# EAGLE design 2020_Example_USBController (EAGLE 9.5.2)
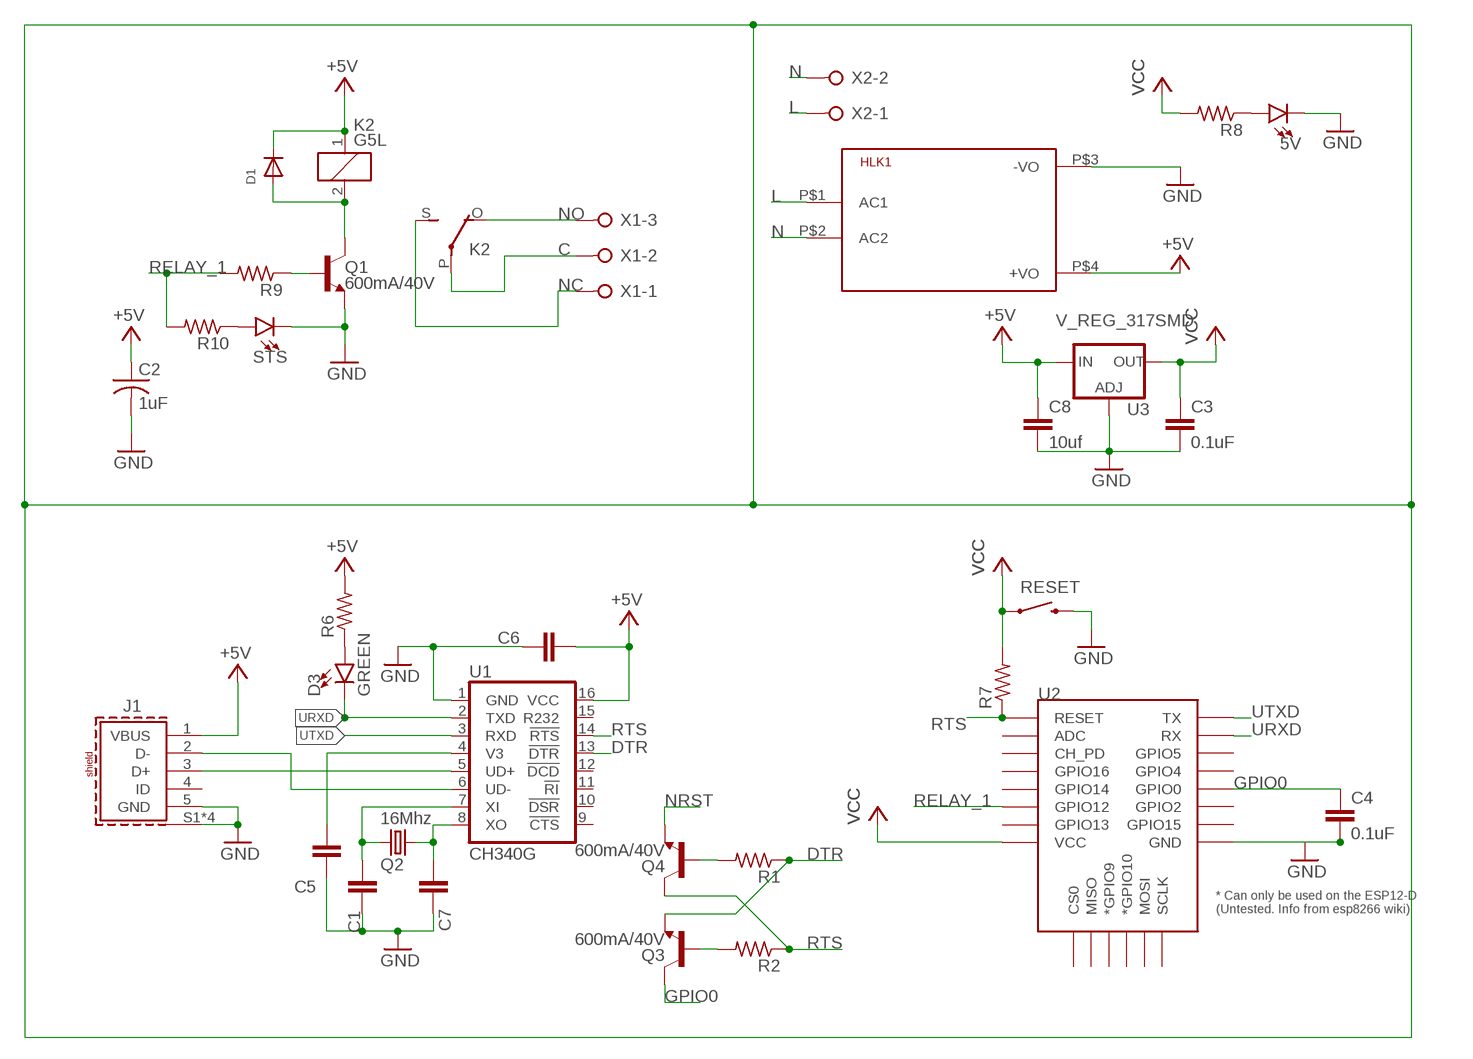
[diagram p0: schematic, sheet 1]

## Parts
5V  LED-GREEN0603  [LED-0603]
C1  10pF  C-EUC0805  [C0805]
C2  1uF  C-USC0805K  [C0805K]
C3  0.1uF  C-EUC0805  [C0805]
C4  0.1uF  C-EUC0805  [C0805]
C5  10nF  C-EUC0805  [C0805]
C6  0.1uF  C-EUC0805  [C0805]
C7  10pF  C-EUC0805  [C0805]
C8  10uf  C-EUC0805  [C0805]
D1  DIODESOD-123  [SOD-123]
D3  GREEN  LED-GREEN0603  [LED-0603]
HLK1  HLK-PM013W  [HLK-PM01]
J1  629105150521  [629105150521]
K2  G5L  [G5LE]
Q1  600mA/40V  TRANS_NPN-MMBT2222AL  [SOT23-3]
Q2  16Mhz  5032/2P  [5032/2P]
Q3  600mA/40V  TRANS_NPN-MMBT2222AL  [SOT23-3]
Q4  600mA/40V  TRANS_NPN-MMBT2222AL  [SOT23-3]
R1  R-US_R0805  [R0805]
R2  R-US_R0805  [R0805]
R6  R-US_R0805  [R0805]
R7  R-US_R0805  [R0805]
R8  R-US_R0805  [R0805]
R9  R-US_R0805  [R0805]
R10  R-US_R0805  [R0805]
RESET  RS032G05A3SM-SPST-MOMENTARY-SWSMD-1101NE  [TACTILE-SWITCH-1101NE]
STS  LED-GREEN0603  [LED-0603]
U1  CH340G  CH340GSMD  [SO016]
U2  ESP12ESMD  [ESP12E-SMD]
U3  V_REG_317SMD  [SOT223]
X1  W237-03P  [W237-133]
X2  W237-02P  [W237-132]

## Nets
+5V [usbvcc]: C2.1 C6.2 C8.1 D1.C HLK1.P$4(+VO) J1.1(VBUS) K2.1 R6.2 U1.16(VCC) U3.3(IN)
C: K2.P(2:P) X1.2
DTR: Q3.2(E) R1.1 U1.13(!DTR)
GND [gnd]: 5V.C C1.1 C2.2 C3.2 C4.2 C5.1 C6.1 C7.1 C8.2 HLK1.P$3(-VO) J1.5(GND) J1.S1(SHIELD) J1.S2(SHIELD) J1.S3(SHIELD) J1.S4(SHIELD) Q1.2(E) RESET.2 STS.C U1.1(GND) U2.GND U3.1(ADJ)
GPIO0: C4.1 Q3.3(C) U2.GPIO0
L: HLK1.P$1(AC1) X2.1
N: HLK1.P$2(AC2) X2.2
N$2: D3.A R6.1
N$3: D1.A K2.2 Q1.3(C)
N$4: J1.3(D+) U1.5(UD+)
N$5: Q1.1(B) R9.1
N$6: J1.2(D-) U1.6(UD-)
N$7: C7.2 Q2.2 U1.8(XO)
N$8: R10.1 STS.A
N$9: 5V.A R8.1
N$10: Q4.1(B) R1.2
N$12: Q3.1(B) R2.2
N$13: C1.2 Q2.1 U1.7(XI)
NC: K2.S(2:S) X1.1
NO: K2.O(2:O) X1.3
NRST: Q4.2(E)
RELAY_1: R9.2 R10.2 U2.GPIO12
RTS: Q4.3(C) R2.1 R7.1 U1.14(!RTS) U2.RESET
URXD: D3.C U1.2(TXD) U2.RXD0(RX)
UTXD: U1.3(RXD) U2.TXD0(TX)
V1: C5.2 U1.4(V3)
VCC [usbvcc]: C3.1 R7.2 R8.2 RESET.1 U2.VCC U3.2(OUT)
Unconnected: J1.4(ID) U1.9(!CTS) U1.10(!DSR) U1.11(!RI) U1.12(!DCD) U1.15(R232) U2.ADC U2.CH_PD U2.CS0 U2.GPIO2 U2.GPIO4 U2.GPIO5 U2.GPIO9(*GPIO9) U2.GPIO10(*GPIO10) U2.GPIO13 U2.GPIO14 U2.GPIO15 U2.GPIO16 U2.MISO U2.MOSI U2.SCLK

## Library data of the parts
5V STS = SparkFun-LED:LED-GREEN: Green SMD LED Used in manufacturing of various products at SparkFun Packages: 0603 - SMD 0603 package [Product Link] <http://www.futureelectronics.com/en/technologies/semiconductors/optoelectronics/leds/Pages/9894312-LTST-C190GKT.aspx?CrossPart=HSMG-C190&IM=0> LilyPad 1206 - SMD1206 LilyPad package [Product Link] <http://www.futureelectronics.com/en/Technologies/Product.aspx?ProductID=IN150NGHARVATEKCORPORATION2049943&IM=0> 1206 - SMD1206 package [Product Link] <http://www.futureelectronics.com/en/technologies/semiconductors/optoelectronics/leds/Pages/8315665-LTST-C150KGKT.aspx?IM=0> 1206 Bottom Mount -SMD 1206 Bottom Mount [Product Link] <http://www.digikey.com/product-detail/en/lite-on-inc/LTST-C230KGKT/160-1456-1-ND/386854> SparkFun Products: Pro Mini 328 -5V <https://www.sparkfun.com/products/821> RedBoard <https://www.sparkfun.com/products/12757> MP3 Trigger <https://www.sparkfun.com/products/13720> Makey Makey <https://www.sparkfun.com/products/11076>; PROD_ID: DIO-00821; VALUE: GREEN
C1 C4-C7 = resistor:C-EU: CAPACITOR, European symbol
C2 = adafruit:C-US: CAPACITOR, American symbol
C3 C8 = rcl:C-EU: CAPACITOR, European symbol
D1 = adafruit:DIODE: Diode SMADIODE - SMA Surface Mount Package 20V 1A Schottky Diode Digikey: 641-1014-6-ND DO-1N4148 - Through Hole Small Current Diode SOD-123 20V 1 A (.5mV Vf) Schottky Diode - Digikey: MBRX120TPMSCT-ND SOD-323 10V 570mA (.38mV Vf, 3ns) Schottky Diode - Digikey: ZLLS410CT-ND SOD-523 30V 30mA Schottky Diode (RB751S-40TE61) - Digikey: RB751S-40TE61CT-ND SOT23-R/W - SOT23 Package (R = Solder Paste/Reflow Ovens, W = Hand-Soldering) BAT54Film 40V 300mA - Digikey: 497-7162-1-ND
D3 = SparkFun-LED:LED-GREEN: Green SMD LED Used in manufacturing of various products at SparkFun Packages: 0603 - SMD 0603 package [Product Link] <http://www.futureelectronics.com/en/technologies/semiconductors/optoelectronics/leds/Pages/9894312-LTST-C190GKT.aspx?CrossPart=HSMG-C190&IM=0> LilyPad 1206 - SMD1206 LilyPad package [Product Link] <http://www.futureelectronics.com/en/Technologies/Product.aspx?ProductID=IN150NGHARVATEKCORPORATION2049943&IM=0> 1206 - SMD1206 package [Product Link] <http://www.futureelectronics.com/en/technologies/semiconductors/optoelectronics/leds/Pages/8315665-LTST-C150KGKT.aspx?IM=0> 1206 Bottom Mount -SMD 1206 Bottom Mount [Product Link] <http://www.digikey.com/product-detail/en/lite-on-inc/LTST-C230KGKT/160-1456-1-ND/386854> SparkFun Products: Pro Mini 328 -5V <https://www.sparkfun.com/products/821> RedBoard <https://www.sparkfun.com/products/12757> MP3 Trigger <https://www.sparkfun.com/products/13720> Makey Makey <https://www.sparkfun.com/products/11076>; PROD_ID: DIO-00821
HLK1 = HLK-PM01:HLK-PM01: Hi-Link Power Supply HLK-PM01 3W Author: Ahmed Said <https://github.com/AhmedSaid/EAGLELibraries>
J1 = Wurth_Connectors_WR-USB:629105150521: Type B with Pegs, High Current at Pin 1 & Pin 5 Micro USB 2.0 SMT Type B Horizontal 5 Contacts High Current Kind Properties Durability:10 000 Mating cycles Quality Class:10 000 Mating cycles Connector Type:Micro USB Gender:Receptacle Type:Horizontal General Information Operating Temperature:-40up to +105 °C Compliance:RoHS Electrical Properties IR 1:3A Working Voltage:30V (AC) Withstanding Voltage:100V (AC) Contact Resistance:30 mΩ Material Properties Insulator Material:LCP Insulator Flammability Rating:UL94 V-0 Color:Black Contact Material:Copper Alloy Contact Plating: Gold Contact Type:Stamped Shielding Material:Stainless Steel Shielding Plating:Nickel <https://www.we-online.com/catalog/media/o86333v209%20WR-COM_629105150521_family.jpg> Details see: https://www.we-online.com/catalog/en/COM_MICRO_SMT_TYPE_B_HORIZONTAL_HIGH_CURRENT/ Updated by Yingchun, Shan 2020-01-16 2020 (C) Würth Elektronik; APPLICATION: Micro USB 2.0; DATASHEET-URL: https://www.we-online.com/catalog/datasheet/629105150521.pdf; GERDER: Receptacle; INTERFACE-TYPE: Type B; IR1: 3.0A; MOUNT: SMT; PACKAGING: Tape and Reel; PART-NUMBER: 629105150521; PINS: 5; TYPE: Horizontal; WORKING-VOLTAGE: 30V(AC)
K2 = relay:G5L: RELAY 1 x switch, 10 A/120 V AC, 8 A/30 V ADC, Omron; OC_FARNELL: unknown; OC_NEWARK: unknown
Q1 Q3 Q4 = SparkFun-DiscreteSemi:TRANS_NPN: NPN transistor Current controlled devices typically used to amplify current or used as a switch. BC547 - COM-08928 <http://www.sparkfun.com/products/8928> (TO-92 45V 100mA) (1.Collector 2.Base 3.Emitter) 2N3904 - COM-00521 <http://www.sparkfun.com/products/521> (TO-92 40V 200mA) (1.Emitter 2.Base 3.Collector) P2N2222A - COM-12852 <http://www.sparkfun.com/products/12852> (TO-92 40V 600mA) (1.Collector 2.Base 3.Emitter); PROD_ID: TRANS-08049
Q2 = Crystals:5032/2P: Crystal Manufacturer's datasheet <https://datasheet.octopart.com/5032-2P-Xinhunjing-datasheet-30677175.pdf>; CREATED_BY: PCBLayout.com; MANUFACTURER: Xinhunjing; MPN: 5032/2P; PACKAGE: SMD
R1 R2 R6-R10 = adafruit:R-US_: RESISTOR, American symbol
RESET = Switch_Xir:RS032G05A3SM-SPST-MOMENTARY-SW: 6x3.5mm 2-pin Momentary Switch (Push-button) Digikey Link <https://www.digikey.com/products/en?keywords=CKN10388TR-ND> Datasheet <https://media.digikey.com/pdf/Data%20Sheets/C&K/RS-032G05_-SM_RT.pdf>; PROD_ID: SWCH-00815
U1 = SparkFun-DigitalIC:CH340G: A simple USB 2.0 to Serial IC.; PROD_ID: IC-13498
U2 = esp8266modules:ESP12E: ESP12E Module
U3 = SparkFun-IC-Power:V_REG_317: Voltage Regulator Standard LM317 adjustable voltage regulator. AOI (Adjust Output Input). Google 'LM317 Calculator' for easy to use app to get the two resistor values needed. 240/720 for 5V output. 240/390 for 3.3V output. Spark Fun Electronics SKU : COM-00527
X1 = con-wago-508:W237-03P: WAGO SREW CLAMP; OC_FARNELL: unknown; OC_NEWARK: unknown
X2 = con-wago-508:W237-02P: WAGO SREW CLAMP; OC_FARNELL: unknown; OC_NEWARK: unknown

## Net classes
1 power: width 0.178 mm
2 gnd: width 0.305 mm, drill 0.559 mm, clearance 0.254 mm
3 usbvcc: width 0.508 mm, drill 0.61 mm, clearance 0.254 mm

## Board
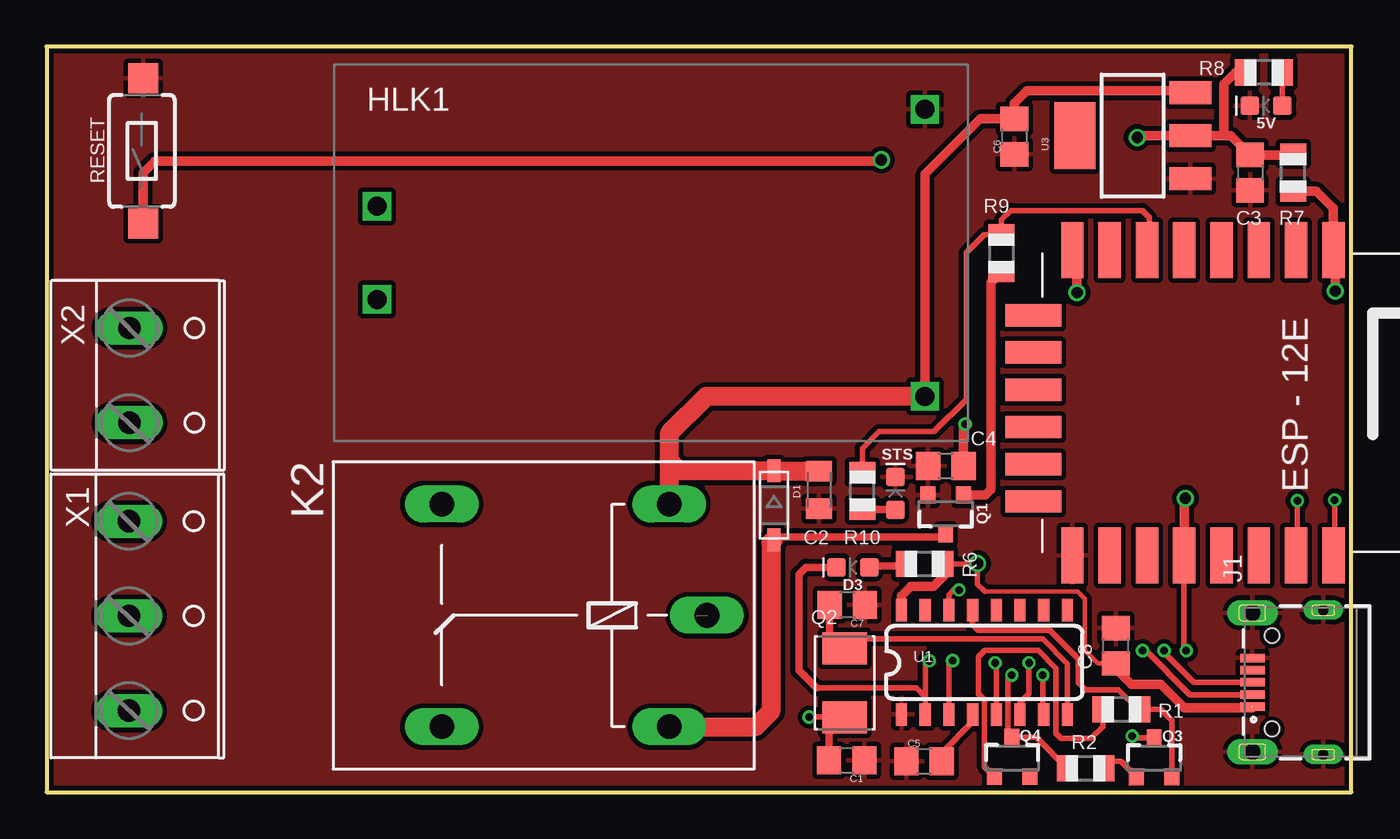
[diagram p1: board, top side]
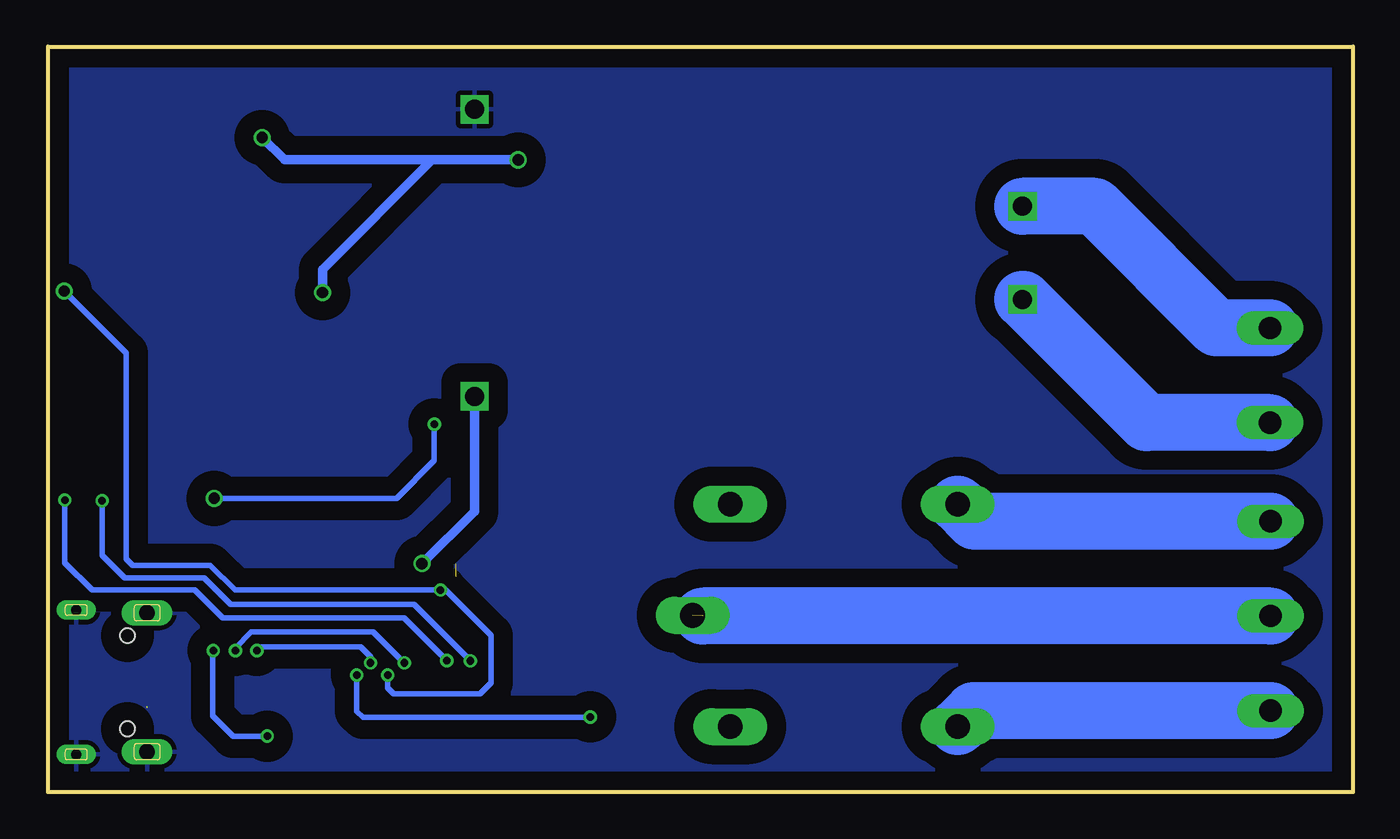
[diagram p2: board, bottom side, seen from below]

Size 70 x 40 mm. Coordinates in mm from the lower left corner, seen from the top.
Outline: 0,0 70,0 70,40 0,40 0,0
Copper layers (1*16): Top 0.035mm / dielectric 1.5mm / Bottom 0.035mm
Design rules "_xircuitos.mx_2L_DRC *": minimum track width 6mil, minimum drill 10mil, track to track 6mil, track to pad 6mil, pad to pad 6mil, via to via 6mil, smd to smd 0mil, copper to edge 10mil, drill to drill 12mil, minimum pad ring 10mil, minimum via ring 6mil, stop-mask expansion 2mil, vias tented up to drill 100mil, thermal gap 10mil

### Footprints (pad centres in the part's own frame; a part is rotated, then mirrored left to right if it is on the bottom)
LED-0603 = smd 1 x 1: A -0.877,0; C 0.877,0
C0805 = smd 1.3 x 1.5: 1 -0.95,0; 2 0.95,0
C0805K = smd 1.1 x 1.4: 1 -1,0; 2 1,0
SOD-123 = smd 1.2 x 0.7: A 1.85,0; C -1.85,0
HLK-PM01 = drill 1.016 square: P$1 -14.7,2.5; P$2 -14.7,-2.5; P$3 14.7,7.7; P$4 14.7,-7.7
629105150521 = smd 0.45 x 1.3: 1 -1.3,2.9; 2 -0.65,2.9; 3 0,2.9; 4 0.65,2.9; 5 1.3,2.9 | drill 0.85 pad 1.2 long: S1 -3.725,2.9; S2 3.725,2.9 | drill 0.55 pad 0.9 long: S3 3.875,-0.9; S4 -3.875,-0.9 | hole 0.8: -2.5,1.85; 2.5,1.85
G5LE = drill 1.321 long: 1 -7.493,-5.969; 2 -7.493,5.969; O 4.699,5.969; P -9.525,0; S 4.699,-5.969
SOT23-3 = smd 0.8 x 0.9: 1 -0.95,-1; 2 0.95,-1; 3 0,1.1
5032/2P = smd 1.7 x 2.4: 1 -1.85,0; 2 1.85,0
R0805 = smd 1.1 x 1.4: 1 -1,0; 2 1,0
TACTILE-SWITCH-1101NE = smd 1.6 x 1.6: 1 -0.3,0; 2 7.5,0
SO016 = smd 0.6 x 1.2: 1 -4.445,-2.8; 2 -3.175,-2.8; 3 -1.905,-2.8; 4 -0.635,-2.8; 5 0.635,-2.8; 6 1.905,-2.8; 7 3.175,-2.8; 8 4.445,-2.8; 9 4.445,2.8; 10 3.175,2.8; 11 1.905,2.8; 12 0.635,2.8; 13 -0.635,2.8; 14 -1.905,2.8; 15 -3.175,2.8; 16 -4.445,2.8
ESP12E-SMD = smd 3 x 1.2: ADC -8.3,3.8; CH_PD -8.3,1.8; GND 8.1,-8.2; GPIO0 8.1,-2.2; GPIO2 8.1,-4.2; GPIO4 8.1,-0.2; GPIO5 8.1,1.8; GPIO12 -8.3,-4.2; GPIO13 -8.3,-6.2; GPIO14 -8.3,-2.2; GPIO15 8.1,-6.2; GPIO16 -8.3,-0.2; RESET -8.3,5.8; RXD0 8.1,3.8; TXD0 8.1,5.8; VCC -8.3,-8.2 | smd 1.2 x 3: CS0 -4.8,-10.3; GPIO9 -0.8,-10.3; GPIO10 1.2,-10.3; MISO -2.8,-10.3; MOSI 3.2,-10.3; SCLK 5.2,-10.3
SOT223 = smd 1.219 x 2.235: 1 -2.311,-3.099; 2 0,-3.099; 3 2.311,-3.099 | smd 3.6 x 2.2: 4 0,3.099
W237-133 = drill 1.194 long: 1 -5.08,-0.635; 2 0,-0.635; 3 5.08,-0.635
W237-132 = drill 1.194 long: 1 -2.54,-0.635; 2 2.54,-0.635

### Placement (x,y rotation side)
5V  65.42,36.83 180 top
C1  42.92,1.7 180 top
C2  41.44,16.21 270 top
C3  64.56,33.23 270 top
C4  48.24,17.49 180 top
C5  47.07,1.66 0 top
C6  51.93,35.17 90 top
C7  42.96,10.04 180 top
C8  57.36,7.85 90 top
D1  39.02,15.39 270 top
D3  43.26,12.06 180 top
HLK1  32.42,28.93 0 top
J1  67.59,5.89 90 top
K2  25.9,9.48 180 top
Q1  48.23,14.94 180 top
Q2  42.82,5.86 90 top
Q3  59.41,1.82 0 top
Q4  51.79,1.83 0 top
R1  57.65,4.43 180 top
R2  55.74,1.28 0 top
R6  47.1,12.25 0 top
R7  66.87,33.24 90 top
R8  65.3,38.61 180 top
R9  51.23,28.92 90 top
R10  43.76,16.16 90 top
RESET  5.18,30.81 90 top
STS  45.53,16.02 90 top
U1  50.31,6.96 0 top
U2  63.23,20.79 270 top
U3  58.26,35.22 90 top
X1  5.05,9.45 270 top
X2  5.08,22.36 270 top

### Tracks (layer width: path | path; a pad name or v marks a point on that pad's centre or on a via)
+5V  (via drill 0.61)  (2 unrouted)
  Top 0.254: 50.29,10.76 50.33,10.76 55.3,10.76 55.69,10.37 55.69,7.6 56.39,6.9 C8.1
  Top 0.305: R6.2 49.89,12.25 49.93,12.21 49.94,12.22 v49.94,12.26 49.94,11.15 50.33,10.76
  Top 0.508: U1.16 45.87,10.53 46.36,11.02 47.56,11.02 48.1,11.56 | C8.1 57.36,6.6 58.19,5.77 59.77,5.77 61.03,4.51 64.69,4.51 | U3.3 61.26,37.63 52.59,37.63 51.93,36.97 C6.2 50.09,36.12 47.12,33.15 HLK1.P$4
  Top 1.016: HLK1.P$4 35.39,21.23 33.39,19.23 33.39,17.79 | 33.39,17.79 K2.1 | 33.39,17.79 33.94,17.24 D1.C 39.05,17.21 C2.1
  Bottom 0.508: HLK1.P$4 47.12,15.07 v49.93,12.26 v49.94,12.26
C  (1 unrouted)
  Bottom 3.048: X1.2 34.88,9.45
DTR
  Top 0.305: Q3.2 60.36,3.84 59.77,4.43 R1.1 58.56,4.43 57.5,5.49 55.74,5.49 55.36,5.87 55.36,7.14 53.83,8.67 50.06,8.67 50,8.67 49.67,8.99 U1.13
GND
  pour Top: 0.38,0.59 0.38,39.61 69.6,39.61 69.6,0.34 68.81,0.34 0.38,0.34 0.38,0.58
  pour Bottom (isolate 1.016): 0.42,39.55 69.56,39.55 69.56,0.35 69.57,0.34 0.42,0.34
GPIO0  (via drill 0.41, 0.61)
  Top 0.305: Q3.3 58.32,2.92 v58.24,3 | v61.14,7.59 61,7.73 61.01,12.67 U2.GPIO0
  Top 0.508: C4.1 49.19,19.65 v49.28,19.74 | v61.09,15.76 61.03,15.7 U2.GPIO0
  Bottom 0.305: v58.24,3 60.08,3 61.17,4.09 61.17,7.56 v61.14,7.59 | v61.09,15.76 51.31,15.76 49.28,17.79 v49.28,19.74
L
  Bottom 3.048: X2.1 7.32,24.9 13.85,31.43 HLK1.P$1
N
  Bottom 3.048: X2.2 11.07,19.82 17.68,26.43 HLK1.P$2
N$2
  Top 0.406: R6.1 45.98,12.13 44.21,12.13 D3.A
N$3
  Top 0.406: Q1.3 48.07,13.68 39.16,13.68 D1.A
  Top 1.016: K2.2 38.03,3.51 38.85,4.33 38.85,13.37 D1.A
N$4  (via drill 0.41)
  Top 0.305: v50.89,6.93 50.95,6.88 U1.5 | v59.94,7.59 59.94,7.49 61.54,5.89 J1.3
  Bottom 0.305: v50.89,6.93 52.56,8.6 59.09,8.6 59.94,7.75 v59.94,7.59
N$5
  Top 0.508: Q1.1 50.36,15.94 50.66,16.24 50.66,27.35 R9.1
N$6  (via drill 0.41)
  Top 0.305: v58.8,7.59 58.96,7.59 61.33,5.22 64.67,5.22 J1.2 | U1.6 52.22,4.79 52.7,5.28 v52.7,6.93
  Bottom 0.305: v58.8,7.59 58.7,7.78 53.22,7.78 52.7,7.26 v52.7,6.93
N$7
  Top 0.305: Q2.2 43.32,8.21 53.45,8.21 54.77,6.89 54.77,4.17 U1.8
  Top 0.406: Q2.2 42.01,8.52 C7.2
N$8
  Top 0.406: R10.1 45.51,15.16 STS.A
N$9
  Top 0.305: 5V.A R8.1
N$10
  Top 0.305: Q4.1 50.31,1.36 50.31,4.96 50,5.27 50,7.26 50.34,7.6 53.2,7.6 54.15,6.65 54.15,3.14 54.41,2.88 56.02,2.88 56.65,3.51 R1.2
N$12
  Top 0.305: Q3.1 57.64,1.64 57.1,1.64 R2.2
N$13  (via drill 0.41)
  Top 0.305: U1.7 53.45,4.2 53.45,6.21 v53.44,6.27 | v40.91,4.03 42.8,4.03 Q2.1
  Top 0.406: C1.2 41.97,3.16 Q2.1
  Bottom 0.305: v53.44,6.27 53.44,4.34 53.11,4.01 40.92,4.01 v40.91,4.02 v40.91,4.03
NC
  Bottom 3.048: X1.1 20.28,14.53 K2.S
NO
  Bottom 3.048: X1.3 20.34,4.37 K2.O
RELAY_1
  Top 0.305: U2.GPIO12 59.17,28.95 59.17,30.81 58.78,31.2 51.72,31.2 51.23,30.71 R9.2 50.31,29.92 49.33,28.94 49.33,21.06 47.61,19.34 44.66,19.34 43.76,18.44 R10.2
RTS  (via drill 0.41, 0.61)
  Top 0.305: R2.1 53.09,2.93 Q4.3 51.57,3.15 51.57,6.06 v51.78,6.27 | v48.95,10.84 48.66,10.84 48.41,10.59 U1.14
  Top 0.508: R7.1 68.11,32.23 69.03,31.32 U2.RESET 69.13,28.99 v69.13,26.88
  Bottom 0.305: v51.78,6.27 51.78,5.6 51.46,5.28 46.82,5.28 46.24,5.86 46.24,8.42 48.67,10.84 v48.95,10.84 59.96,10.84 61.29,12.17 65.47,12.17 65.8,12.5 65.8,23.55 v69.13,26.88
URXD  (via drill 0.41)
  Top 0.305: 41.29,5.6 41.31,5.58 46.65,5.58 47.13,5.09 U1.2 47.13,6.83 v47.34,7.04 | v67.1,15.64 67.1,12.76 U2.RXD0
  Top 0.406: D3.C 40.73,12.06 40.36,11.69 40.36,6.53 41.29,5.6
  Bottom 0.305: v47.34,7.04 50.36,10.06 60.2,10.06 61.63,11.49 65.88,11.49 67.1,12.71 v67.1,15.64
UTXD  (via drill 0.41)
  Top 0.305: U1.3 48.41,6.86 v48.6,7.05 | v69.1,15.67 69.1,12.76 U2.TXD0
  Bottom 0.305: v48.6,7.05 50.89,9.34 60.64,9.34 62.14,10.84 67.64,10.84 69.1,12.3 v69.1,15.67
V1
  Top 0.305: C5.2 48.02,2.11 49.67,3.77 U1.4
VCC  (via drill 0.61)
  Top 0.508: R7.2 66.82,34.19 C3.1 63.52,35.22 63.14,35.22 | 63.14,35.22 U3.2 58.61,35.22 v58.51,35.12 | 63.14,35.22 63.14,37.97 63.78,38.61 R8.2 | RESET.1 5.18,33.23 5.8,33.85 44.71,33.85 v44.78,33.92 | v55.28,26.8 v55.27,26.81 55.27,28.85 U2.VCC
  Bottom 0.508: v44.78,33.92 49.4,33.92 | v55.28,26.8 55.28,28.04 49.4,33.92 | 49.4,33.92 57.31,33.92 v58.51,35.12